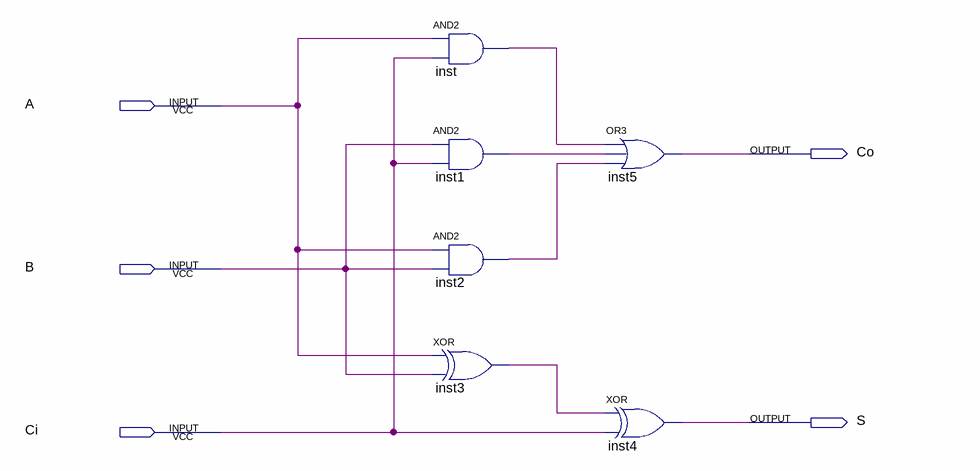
[diagram p0: schematic sheet]
// Quartus schematic FullAdder1.bdf as structural Verilog: 6 symbols, 5 pins
module FullAdder1 (
  input  A,
  input  B,
  input  Ci,
  output Co,
  output S
);

  wire inst1_out, inst2_out, inst3_out, inst_out;

  and inst (inst_out, A, Ci);
  and inst1 (inst1_out, B, Ci);
  and inst2 (inst2_out, A, B);
  xor inst3 (inst3_out, A, B);
  or inst5 (Co, inst_out, inst1_out, inst2_out);
  xor inst4 (S, inst3_out, Ci);
endmodule
